# Altium schematic sheet PROC051D_Cover_Sheet.SchDoc: Contents
size 431 x 279 mm; Date: Not shown in title block; ApprovedBy: Not shown in title block; CheckedBy: Not shown in title block; Author: Not shown in title block; CompanyName: Not shown in title block; Engineer: Not shown in title block; Organization: Not shown in title block; Address1: Not shown in title block; Address2: Not shown in title block; Address3: Not shown in title block; Address4: Not shown in title block; DocumentNumber: 1; Revision: Use project parameter SCH_Rev; SheetNumber: 1; SheetTotal: 16; PageSetup: Record=PageOptions|CenterHorizontal=True|CenterVertical=True|PrintScale=0.64|XCorrection=1.00|YCorrection=1.00|PrintKind=0|BorderSize=5000000|LeftOffset=0|BottomOffset=0|Orientation=2|PaperLength=1000|PaperWidth=1000|Scale=100|PaperSource=15|PrintQuality=600|MediaType=1|DitherType=10|PrintScaleMode=1|PaperKind=Letter; CurrentTime: Not shown in title block; CurrentDate: Not shown in title block; Time: Not shown in title block; DocumentFullPathAndName: Not shown in title block; DocumentName: Not shown in title block; ModifiedDate: Not shown in title block; ImagePath: Not shown in title block
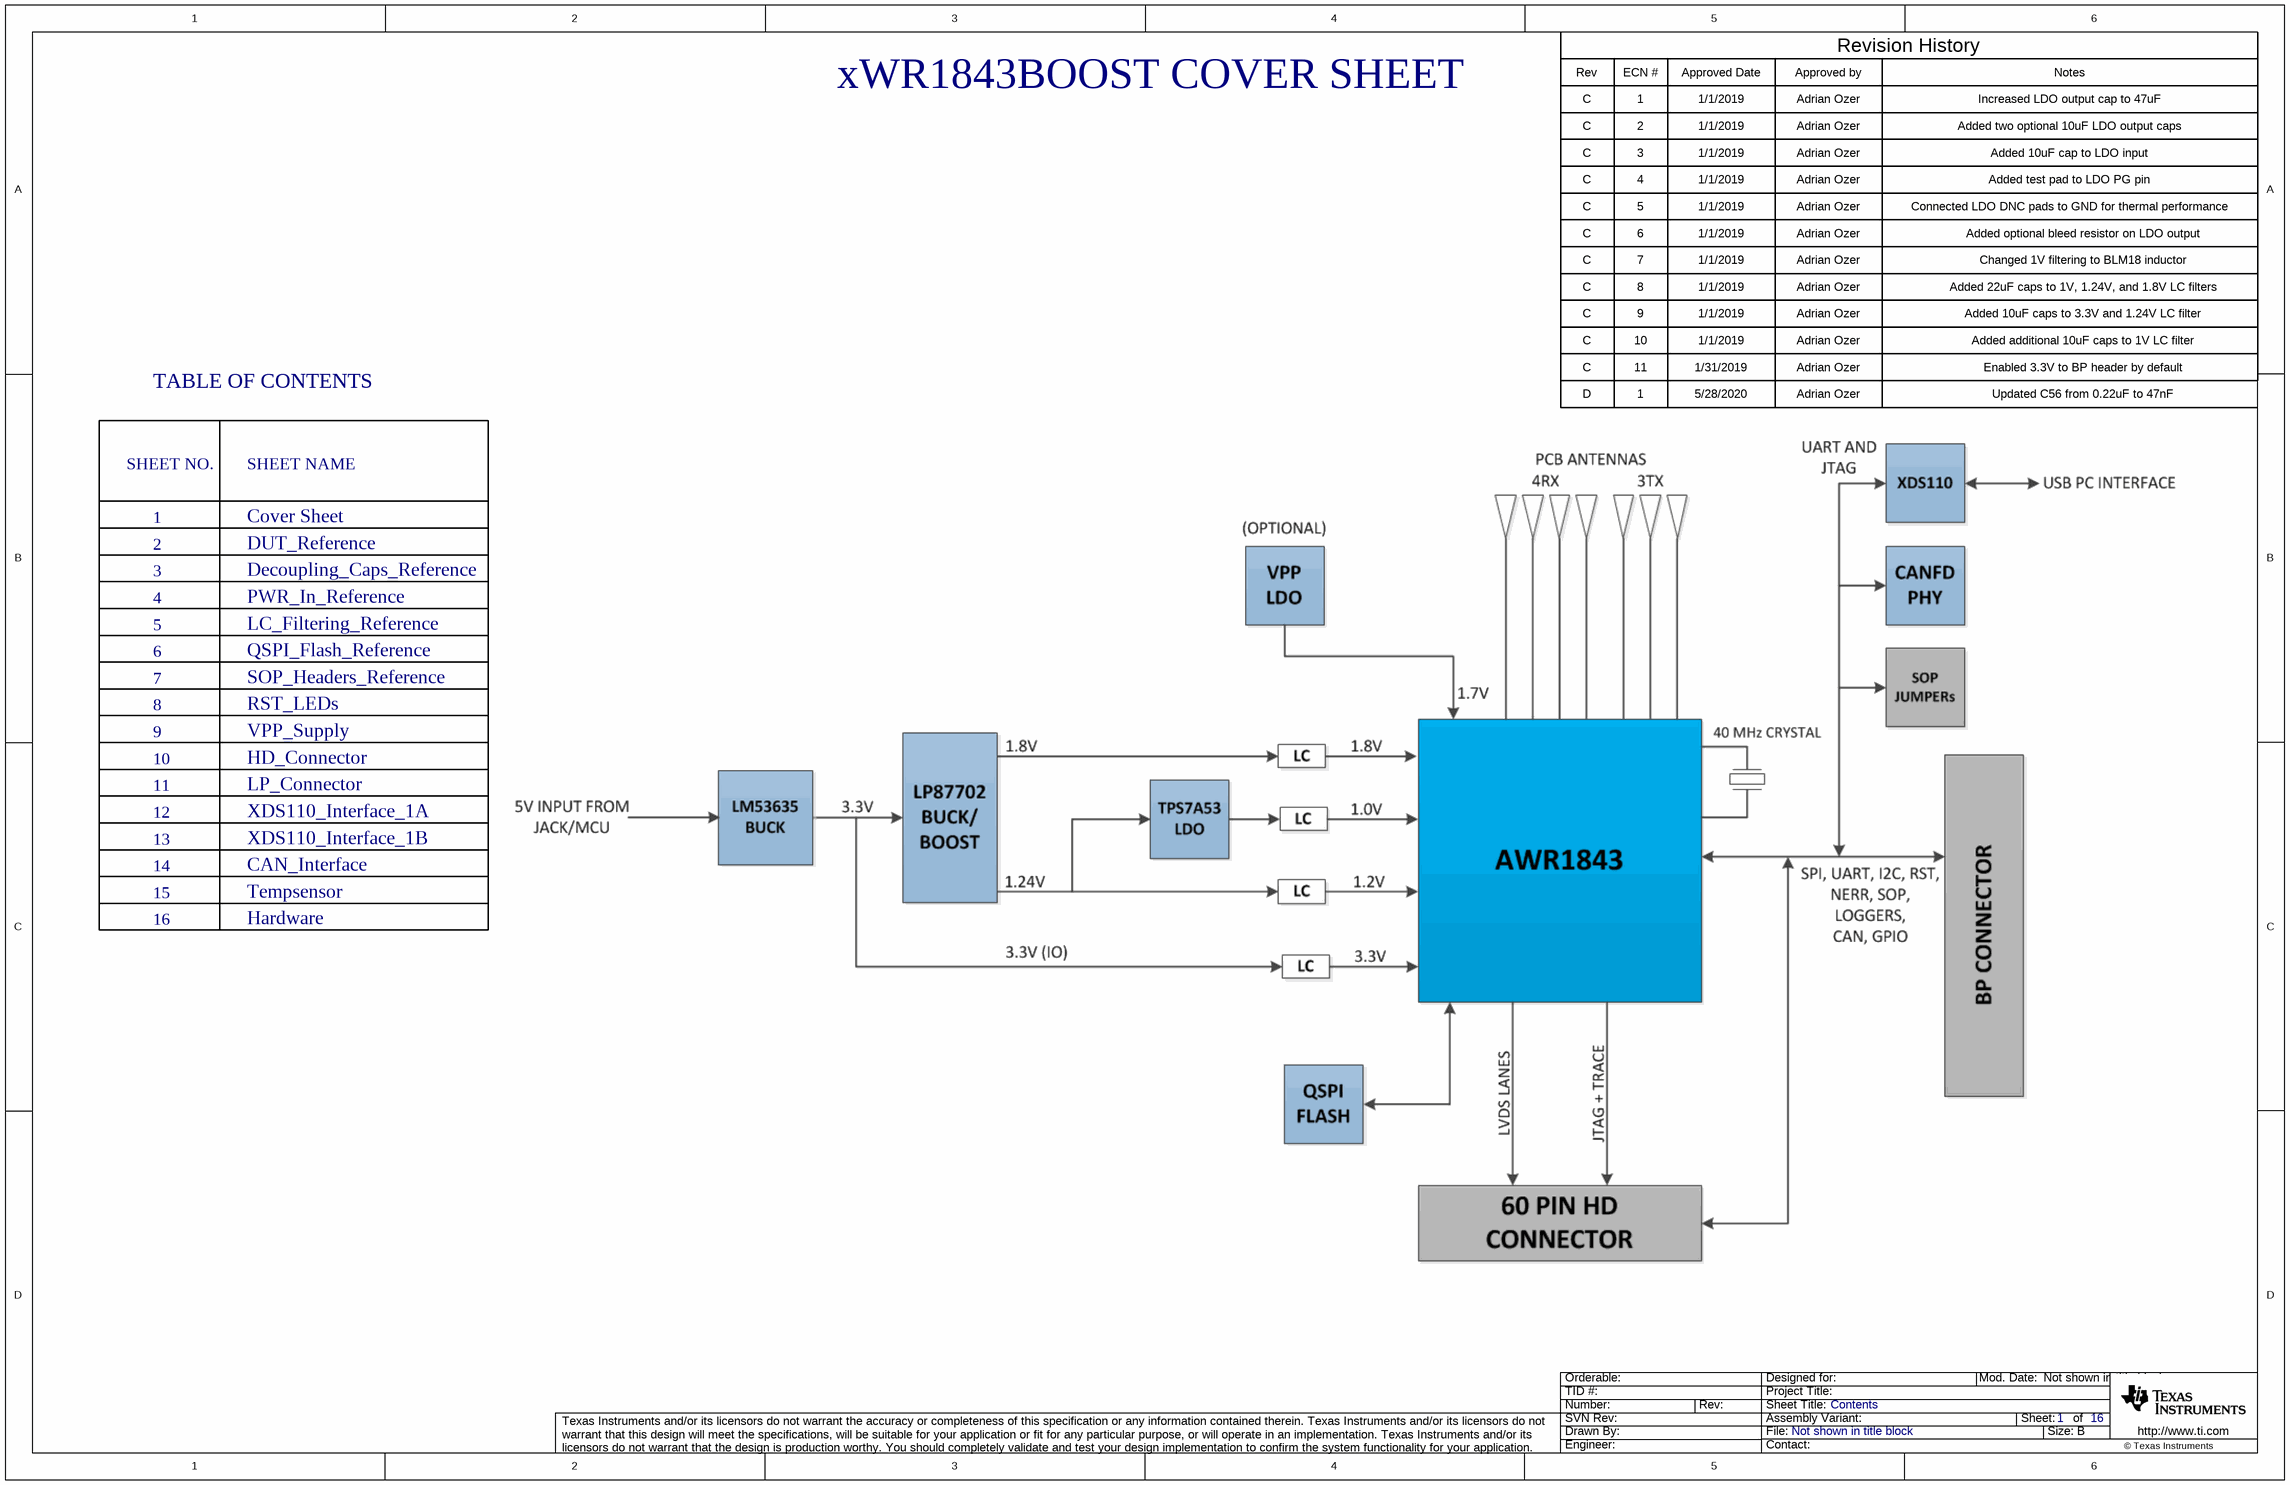
[diagram p0: PROC051D_Cover_Sheet.SchDoc]

## Notes on the sheet
- xWR1843BOOST COVER SHEET
- Rev
- C
- ECN #
- 1
- Approved Date
- 1/1/2019
- Approved by
- Adrian Ozer
- Revision History
- Notes
- Increased LDO output cap to 47uF
- 2
- 3
- Added two optional 10uF LDO output caps
- Added 10uF cap to LDO input
- 4
- 5
- 6
- Added test pad to LDO PG pin
- Connected LDO DNC pads to GND for thermal performance
- Added optional bleed resistor on LDO output
- 7
- 8
- Changed 1V filtering to BLM18 inductor
- Added 22uF caps to 1V, 1.24V, and 1.8V LC filters
- 9
- 10
- 11
- 1/31/2019
- Added 10uF caps to 3.3V and 1.24V LC filter
- Added additional 10uF caps to 1V LC filter
- Enabled 3.3V to BP header by default
- TABLE OF CONTENTS
- D
- 5/28/2020
- Updated C56 from 0.22uF to 47nF
- SHEET NO.
- SHEET NAME
- Cover Sheet
- DUT_Reference
- Decoupling_Caps_Reference
- PWR_In_Reference
- LC_Filtering_Reference
- QSPI_Flash_Reference
- SOP_Headers_Reference
- RST_LEDs
- VPP_Supply
- HD_Connector
- 12
- LP_Connector
- XDS110_Interface_1A
- 13
- 15
- 14
- XDS110_Interface_1B
- Tempsensor
- CAN_Interface
- 16
- Hardware
- Drawn By:
- SVN Rev:
- Number:
- TID #:
- Orderable:
- Rev:
- Sheet Title:
- File:
- Project Title:
- Designed for:
- Assembly Variant:
- Mod. Date:
- Sheet:
- Size:
- of
- B
- http://www.ti.com
- Texas Instruments and/or its licensors do not warrant the accuracy or completeness of this specification or any information contained therein. Texas Instruments and/or its licensors do not warrant that this design will meet the specifications, will be suitable for your application or fit for any particular purpose, or will operate in an implementation. Texas Instruments and/or its licensors do not warrant that the design is production worthy. You should completely validate and test your design implementation to confirm the system functionality for your application.
- Engineer:
- Contact:
- © Texas Instruments